# EAGLE design log-controller-v2 (EAGLE 7.5.0)
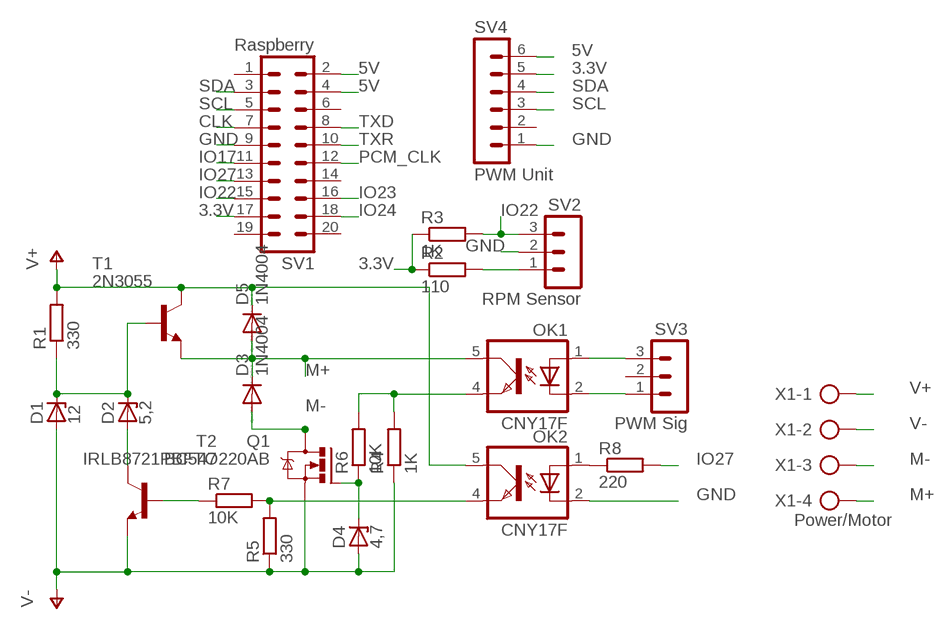
[diagram p0: schematic, sheet 1]

## Parts
D1  12  BZX90  [DO34Z7]
D2  5,2  BZX90  [DO34Z7]
D3  1N4004  [DO41-10]
D4  4,7  BZX90  [DO34Z7]
D5  1N4004  [DO41-10]
OK1  CNY17F  [DIL06]
OK2  CNY17F  [DIL06]
Q1  IRLB8721PBFTO220AB  [TO220AB]
R1  330  R-EU_0207/12  [0207/12]
R2  110  R-EU_0207/10  [0207/10]
R3  1K  R-EU_0207/10  [0207/10]
R4  1K  R-EU_0207/12  [0207/12]
R5  330  R-EU_0207/12  [0207/12]
R6  10K  R-EU_0207/12  [0207/12]
R7  10K  R-EU_0207/12  [0207/12]
R8  220  R-EU_0207/10  [0207/10]
SV1  Raspberry  MA10-2  [MA10-2]
SV2  RPM Sensor  MA03-1  [MA03-1]
SV3  PWM Sig  MA03-1  [MA03-1]
SV4  PWM Unit  MA06-1  [MA06-1]
T1  2N3055  [TO3]
T2  BC547  [TO92]
X1  Power/Motor  AK300/4  [AK300/4]

## Nets
3.3V: R2.1 R3.1 SV1.17 SV4.5
5V: SV1.2 SV1.4 SV4.6
CLK: SV1.7
GND: OK2.2(C) SV1.9 SV2.2 SV4.1
IO17 [power]: SV1.11
IO22: R3.2 SV1.15 SV2.3
IO23: SV1.16
IO24: SV1.18
IO27: R8.2 SV1.13
M+ [power]: D3.C D5.A OK1.5(COL) T1.E X1.4
M- [power]: D3.A Q1.D X1.3
N$1 [power]: D1.C D2.C R1.1 T1.B
N$2: D2.A T2.3(C)
N$3: OK1.4(EMIT) R4.2 R6.2
N$4 [power]: R2.2 SV2.1
N$5: OK1.1(A) SV3.3
N$6: OK1.2(C) SV3.1
N$7: OK2.4(EMIT) R5.2 R7.2
N$8: R7.1 T2.2(B)
N$9: D4.C Q1.G R6.1
N$10: OK2.1(A) R8.1
PCM_CLK: SV1.12
SCL: SV1.5 SV4.3
SDA: SV1.3 SV4.4
TXD: SV1.8
TXR: SV1.10
V+ [power]: D5.C OK2.5(COL) R1.2 T1.C T1.C/(C) X1.1
V- [power]: D1.A D4.A Q1.S R4.1 R5.1 T2.1(E) X1.2
Unconnected: SV1.1 SV1.6 SV1.14 SV1.19 SV1.20 SV3.2 SV4.2

## Library data of the parts
D1 D2 D4 = diode:BZX90: Z DIODE
D3 D5 = diode:1N4004: DIODE general purpose rectifier, 1 A
OK1 OK2 = optocoupler:CNY17F: SIEMENS OPTO COUPLER; MF: VISHAY/TELEFUNKEN; MPN: CNY17F-3; OC_FARNELL: 1469473; OC_NEWARK: 58K0172
Q1 = transistor-power:IRLB8721PBF: N-Channel HEXFET® Power MOSFET very-low RDS(on) Source: http://www.irf.com/product-info/datasheets/data/irlb8721pbf.pdf
R1-R8 = resistor:R-EU_: RESISTOR, European symbol
SV1 = con-lstb:MA10-2: PIN HEADER; OC_FARNELL: unknown; OC_NEWARK: unknown
SV2 SV3 = con-lstb:MA03-1: PIN HEADER; OC_FARNELL: unknown; OC_NEWARK: unknown
SV4 = con-lstb:MA06-1: PIN HEADER; OC_FARNELL: unknown; OC_NEWARK: unknown
T1 = transistor:2N3055: NPN TRANSISTOR
T2 = transistor:BC547: NPN TRANSISTOR
X1 = con-ptr500:AK300/4: CONNECTOR; OC_FARNELL: unknown; OC_NEWARK: unknown

## Net classes
0 default: width 0.5 mm, clearance 0.406 mm
1 power: width 1 mm, clearance 0.5 mm to class 0, clearance 0.5 mm

## Board
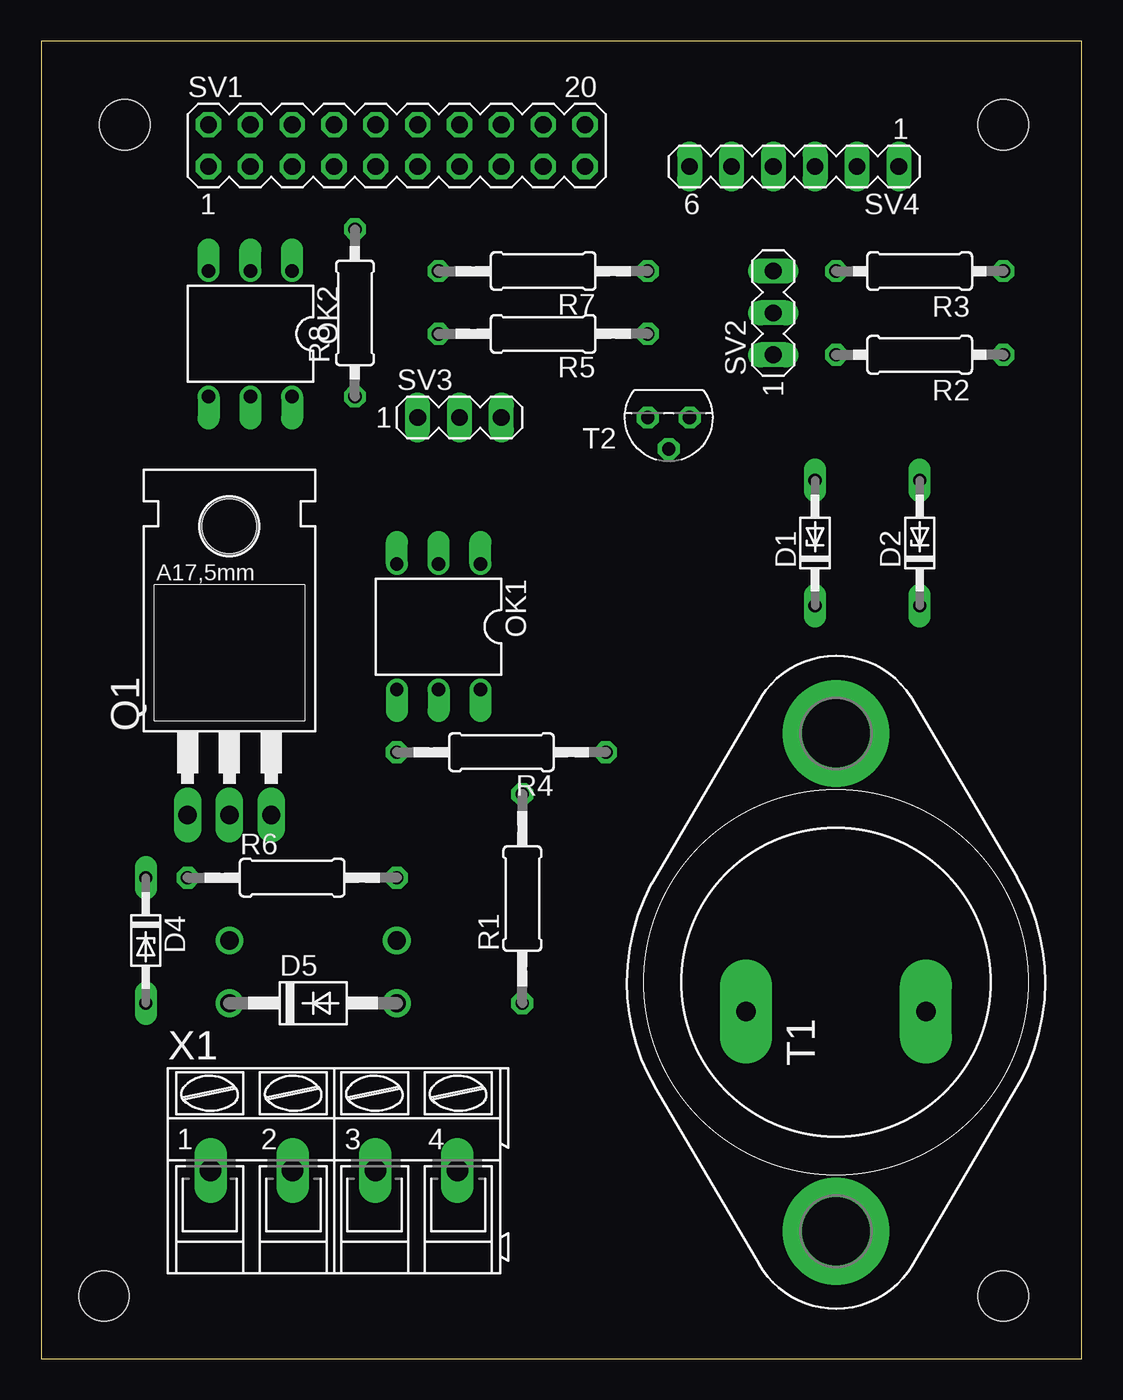
[diagram p1: board, top side]
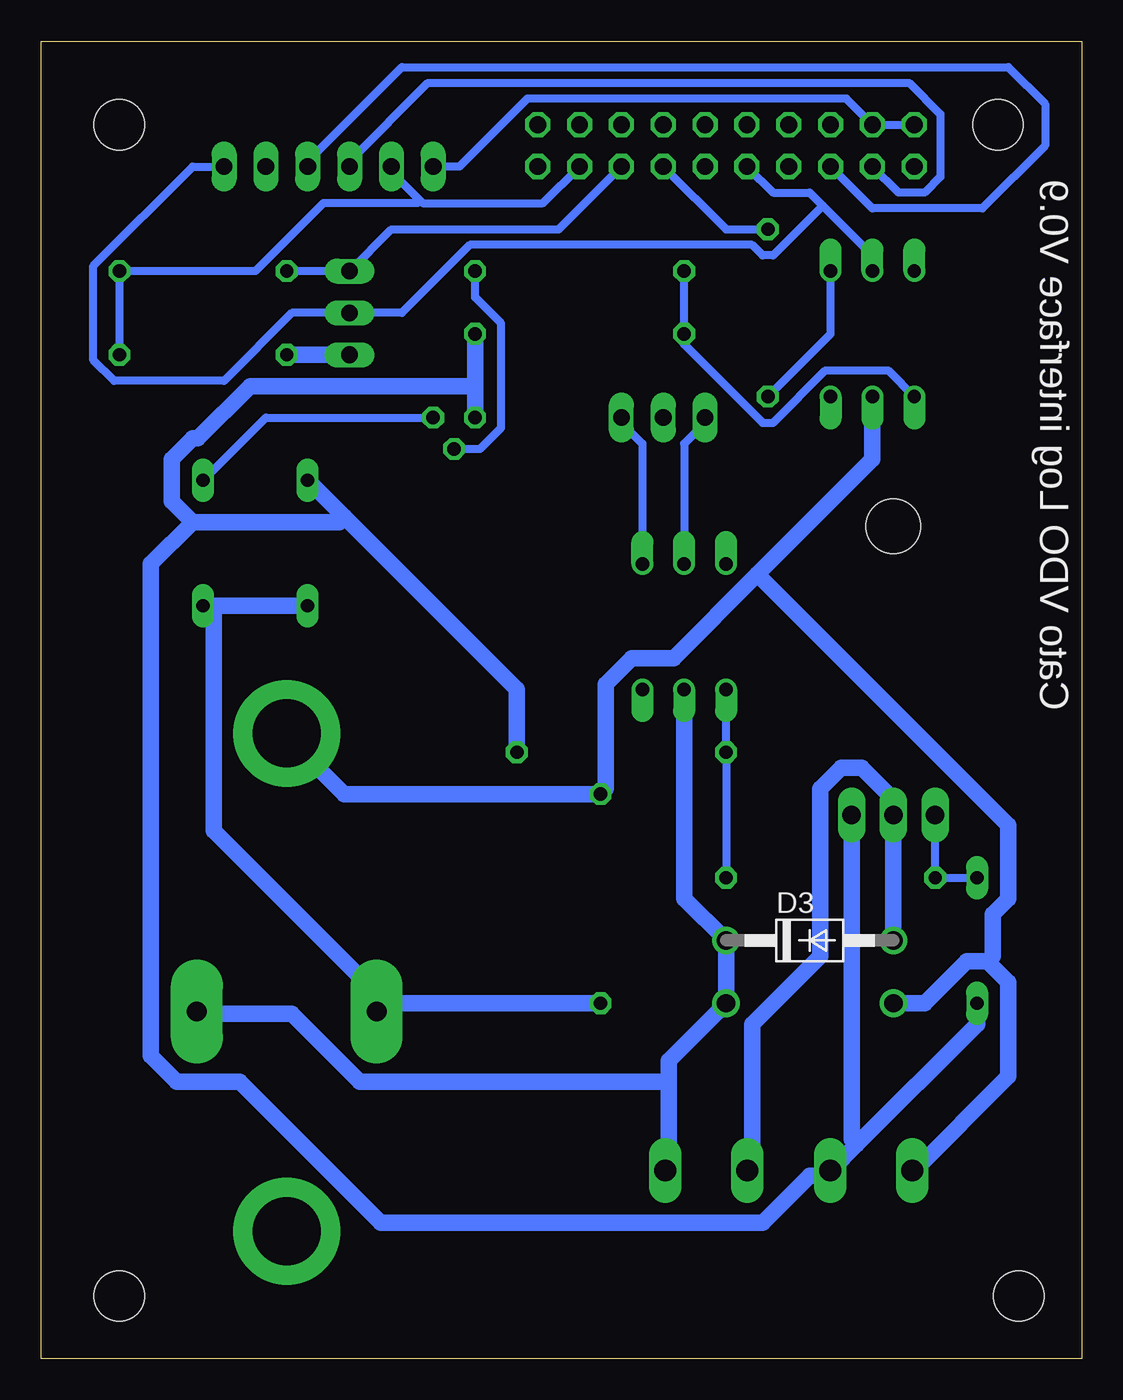
[diagram p2: board, bottom side, seen from below]

Size 63.17 x 80 mm. Coordinates in mm from the lower left corner, seen from the top.
Outline: 0,0 63.17,0 63.17,80 0,80 0,0
Copper layers (1*16): Top 0.035mm / dielectric 1.5mm / Bottom 0.035mm
Design rules "default": minimum track width 10mil, minimum drill 24mil, track to track 8mil, track to pad 8mil, pad to pad 8mil, via to via 8mil, smd to smd 8mil, copper to edge 40mil, drill to drill 8mil, minimum pad ring 10mil, minimum via ring 8mil, stop-mask expansion 4mil, vias tented up to drill 0mil, thermal gap 10mil
Holes 3.05 mm at 5.08,74.93 58.42,74.93 3.81,3.81 58.42,3.81

### Footprints (pad centres in the part's own frame; a part is rotated, then mirrored left to right if it is on the bottom)
DO34Z7 = drill 0.813 long: A 3.81,0; C -3.81,0
DO41-10 = drill 1.118: A 5.08,0; C -5.08,0
DIL06 = drill 0.813 offset: 1 -2.54,-3.81; 2 0,-3.81; 3 2.54,-3.81; 4 2.54,3.81; 5 0,3.81; 6 -2.54,3.81
TO220AB = drill 1.118 long: D 0,-6.35; G -2.54,-6.35; S 2.54,-6.35 | hole 3.302: 0,11.176
0207/12 = drill 0.813 octagon: 1 -6.35,0; 2 6.35,0
0207/10 = drill 0.813 octagon: 1 -5.08,0; 2 5.08,0
MA10-2 = drill 1.016 octagon: 1 -11.43,-1.27; 2 -11.43,1.27; 3 -8.89,-1.27; 4 -8.89,1.27; 5 -6.35,-1.27; 6 -6.35,1.27; 7 -3.81,-1.27; 8 -3.81,1.27; 9 -1.27,-1.27; 10 -1.27,1.27; 11 1.27,-1.27; 12 1.27,1.27; 13 3.81,-1.27; 14 3.81,1.27; 15 6.35,-1.27; 16 6.35,1.27; 17 8.89,-1.27; 18 8.89,1.27; 19 11.43,-1.27; 20 11.43,1.27
MA03-1 = drill 1.016 long: 1 -2.54,0; 2 0,0; 3 2.54,0
MA06-1 = drill 1.016 long: 1 -6.35,0; 2 -3.81,0; 3 -1.27,0; 4 1.27,0; 5 3.81,0; 6 6.35,0
TO3 = drill 1.194 pad 3.15 long: B -1.778,5.461; E -1.778,-5.461 | drill 4.115 pad 6.477: C 15.113,0; C/ -15.113,0
TO92 = drill 0.813 octagon: 1 1.27,0; 2 0,1.905; 3 -1.27,0
AK300/4 = drill 1.321 long: 1 -7.493,0; 2 -2.515,0; 3 2.515,0; 4 7.493,0

### Placement (x,y rotation side)
D1  46.99,49.53 90 top
D2  53.34,49.53 90 top
D3  16.51,25.4 0 bottom
D4  6.35,25.4 270 top
D5  16.51,21.59 0 top
OK1  24.13,44.45 180 top
OK2  12.7,62.23 180 top
Q1  11.43,39.37 0 top
R1  29.21,27.94 90 top
R2  53.34,60.96 180 top
R3  53.34,66.04 180 top
R4  27.94,36.83 180 top
R5  30.48,62.23 180 top
R6  15.24,29.21 0 top
R7  30.48,66.04 180 top
R8  19.05,63.5 90 top
SV1  21.59,73.66 0 top
SV2  44.45,63.5 90 top
SV3  25.4,57.15 0 top
SV4  45.72,72.39 180 top
T1  48.26,22.86 90 top
T2  38.1,57.15 180 top
X1  17.78,11.43 0 top

### Tracks (layer width: path | path; a pad name or v marks a point on that pad's centre or on a via)
3.3V
  Bottom 0.5: R2.1 R3.1 50.16,66.04 46.04,70.17 40.32,70.17 40.16,70.33 | SV1.17 32.7,70.17 40.01,70.17 40.16,70.33 | 40.16,70.33 41.91,72.07 SV4.5
5V
  Bottom 0.5: SV1.2 SV1.4 14.29,76.52 33.66,76.52 37.78,72.39 SV4.6
GND
  Bottom 0.5: OK2.2 12.7,66.99 15.72,70.01 | 15.72,70.01 16.51,70.8 18.73,70.8 SV1.9 | 15.72,70.01 18.73,66.99 19.37,66.99 20,67.63 37.15,67.63 41.27,63.5 SV2.2 47.94,63.5 52.07,59.37 58.74,59.37 60.01,60.64 60.01,66.36 53.98,72.39 SV4.1
IO22
  Bottom 0.5: R3.2 SV2.3 41.91,68.58 31.75,68.58 SV1.15
IO27
  Bottom 0.5: R8.2 21.59,68.58 SV1.13
M+
  Bottom 1: OK1.5 24.13,27.94 D3.C D5.A 25.08,18.1 25.08,16.83 | 25.08,16.83 25.08,11.43 X1.4 | 25.08,16.83 43.81,16.83 47.94,20.95 53.66,20.95 T1.E
M-
  Bottom 0.61: 11.27,33.18 Q1.D
  Bottom 1: D3.A Q1.D 11.75,33.34 11.75,34.29 13.34,35.88 14.61,35.88 15.88,34.61 15.88,24.45 20,20.32 20,11.43 X1.3
N$1
  Bottom 1: D1.C D2.C 52.7,45.4 52.7,32.07 42.55,21.91 T1.B 42.55,21.27 42.23,21.59 R1.1
N$2
  Bottom 0.5: T2.3 49.53,57.15 D2.A
N$3
  Bottom 0.5: R6.2 R4.2 OK1.4
N$4
  Bottom 1: SV2.1 R2.2
N$5
  Bottom 0.5: OK1.1 26.67,55.56 27.94,56.83 SV3.3
N$6
  Bottom 0.5: OK1.2 24.13,55.56 22.86,56.83 SV3.1
N$7
  Bottom 0.5: OK2.4 11.75,60.01 15.56,60.01 18.73,56.83 19.37,56.83 24.13,61.59 R5.2 R7.2
N$8
  Bottom 0.5: R7.1 36.83,64.45 35.24,62.87 35.24,56.52 36.51,55.24 T2.2
N$9
  Bottom 0.5: D4.C R6.1 Q1.G
N$10
  Bottom 0.5: OK2.1 15.24,62.23 R8.1
SCL
  Bottom 0.5: SV1.5 12.7,69.85 6.03,69.85 2.22,73.66 2.22,76.2 4.45,78.42 41.27,78.42 46.99,72.71 SV4.3
SDA
  Bottom 0.5: SV1.3 11.11,70.8 9.53,70.8 8.57,71.75 8.57,75.56 10.48,77.47 39.69,77.47 44.45,72.71 SV4.4
V+
  Bottom 1: D5.C 9.53,21.59 6.99,24.13 5.71,24.13 | 5.71,24.13 4.45,22.86 4.45,17.14 10.16,11.43 X1.1 | T1.C 48.26,37.78 44.77,34.29 R1.2 28.89,34.61 28.89,40.96 27.3,42.55 24.77,42.55 19.68,47.62 | OK2.5 12.7,54.61 19.68,47.62 | 19.68,47.62 4.45,32.38 4.45,27.94 5.4,26.99 5.4,24.45 5.71,24.13
V-
  Bottom 1: D4.A 6.35,20.32 13.65,13.02 | 13.65,13.02 15.24,11.43 X1.2 15.56,11.11 16.51,11.11 19.37,8.26 42.55,8.26 51.12,16.83 54.93,16.83 56.52,18.41 56.52,48.26 53.98,50.8 | Q1.S 13.97,13.34 13.65,13.02 | R5.1 36.83,59.05 | 36.83,59.05 T2.1 | R4.1 34.29,40.64 44.77,51.12 | D1.A 44.77,51.12 | 36.83,59.05 50.48,59.05 53.66,55.88 53.98,55.88 55.24,54.61 55.24,52.07 53.98,50.8 | 53.98,50.8 45.09,50.8 44.77,51.12

### Text on the board
bNames: Cato VDO Log interface V0.9